# Altium schematic sheet WeatherBalloon_Main.SchDoc
size B; SheetNumber: 1; SheetTotal: 1
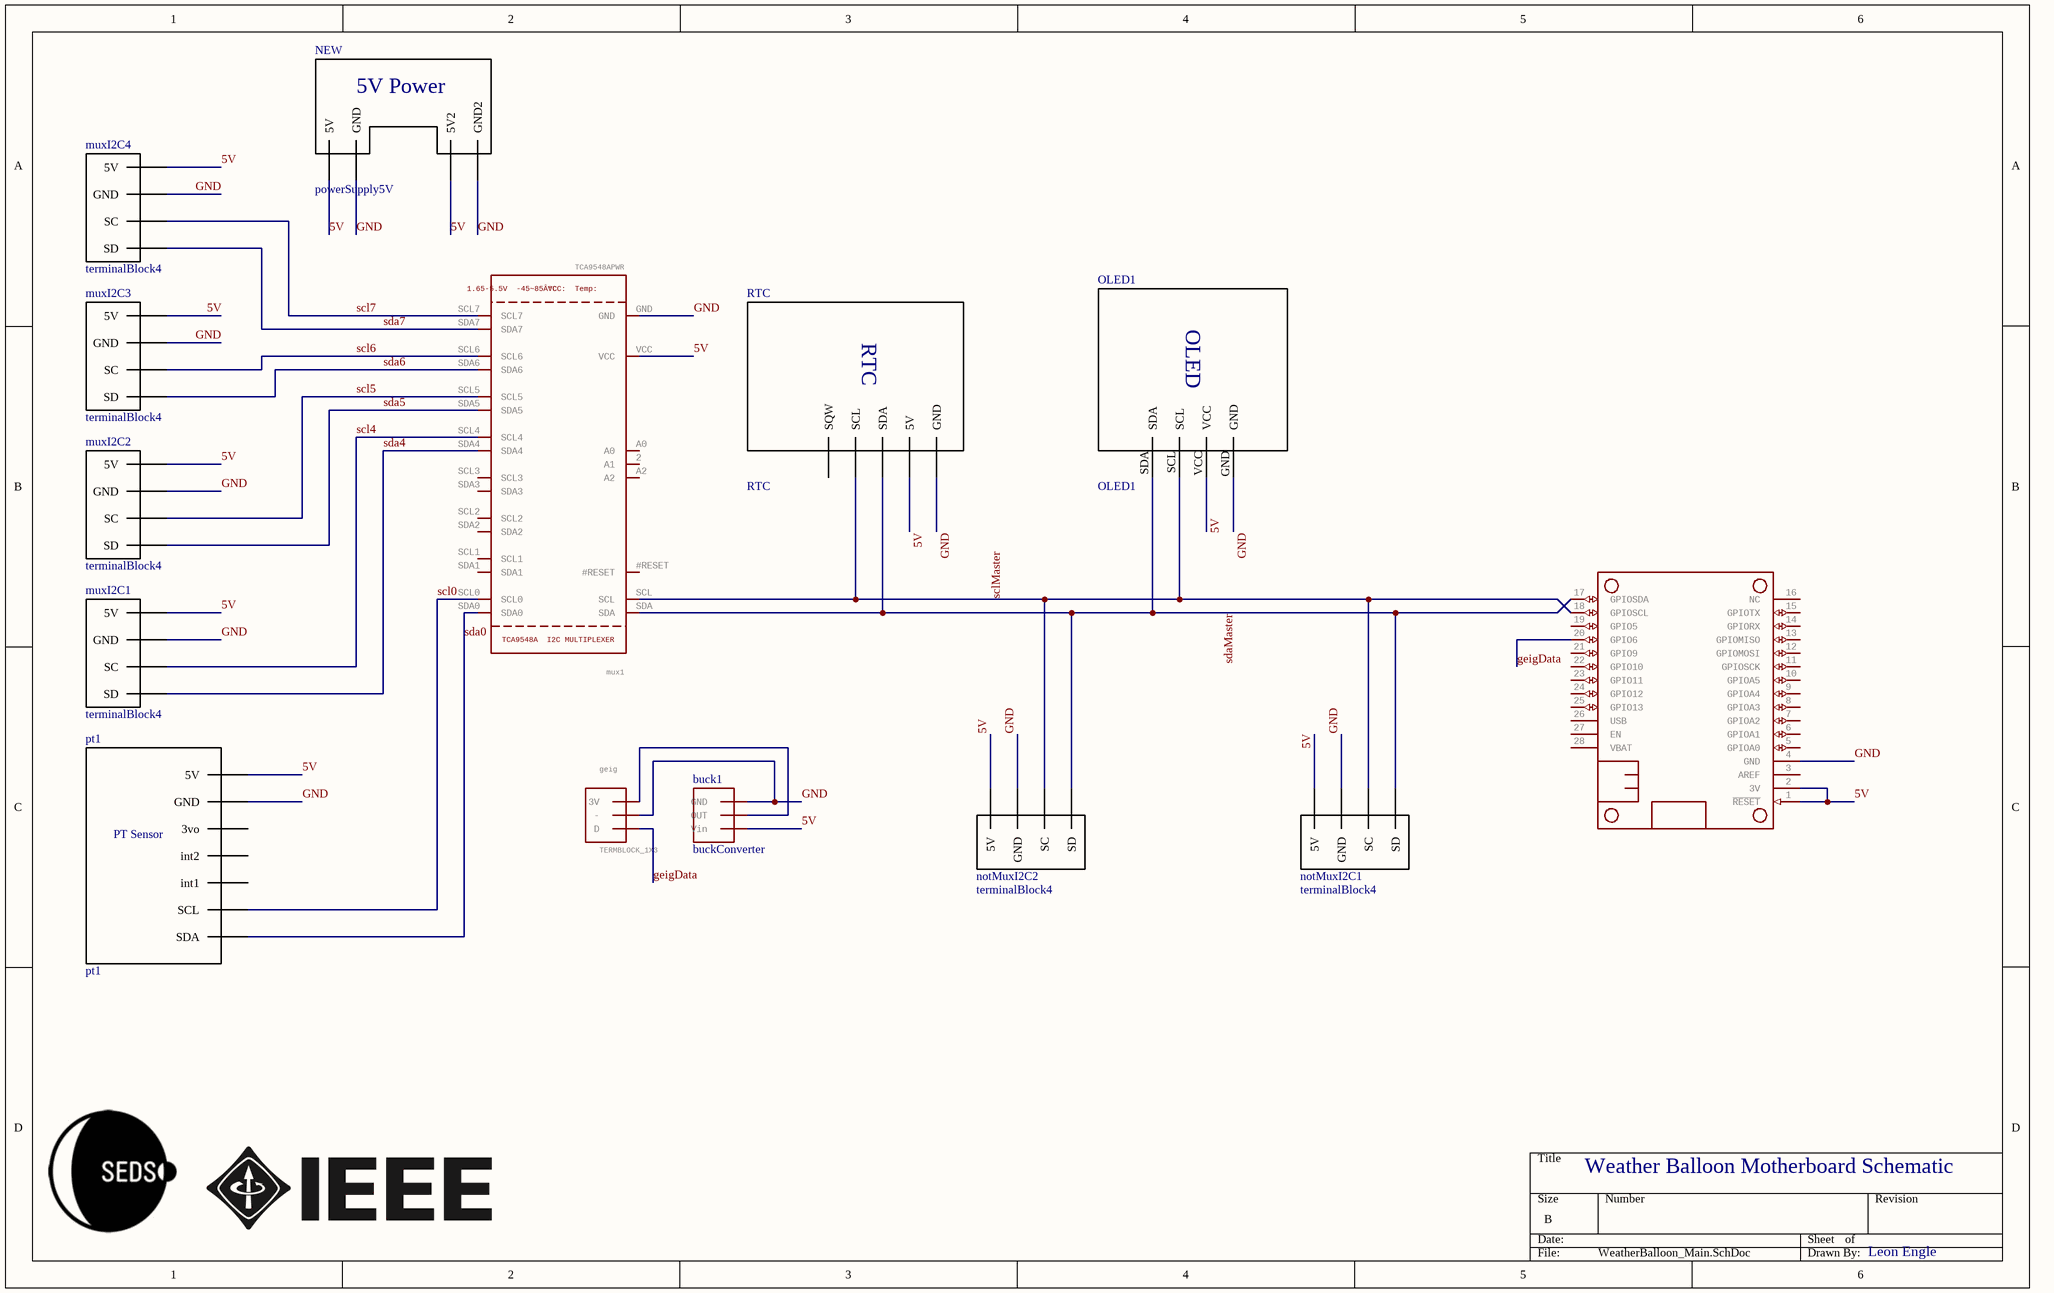
[diagram p0: WeatherBalloon_Main.SchDoc]

## Parts
buck1  buckConverter  [buckConverter]
geig  TERMBLOCK_1X3  [terminal3]
MS?  FEATHERWING_NODIM  [FEATHERWING_DIM]  (value not drawn)
mux1  TCA9548APWR  TCA9548A
I2CMULTIPLEXER: TCA9548A / I2C MULTIPLEXER  VCC:
Temp: VCC: / Temp:  1.65-5.5V
-45~85Â°C: 1.65-5.5V / -45~85Â°C  [multiplexer]
muxI2C1  terminalBlock4  [terminalBlock4]
muxI2C2  terminalBlock4  [terminalBlock4]
muxI2C3  terminalBlock4  [terminalBlock4]
muxI2C4  terminalBlock4  [terminalBlock4]
NEW  powerSupply5V  [powerSupply5V]
notMuxI2C1  terminalBlock4  [terminalBlock4]
notMuxI2C2  terminalBlock4  [terminalBlock4]
OLED1  OLED1  [OLED]
pt1  pt1  [PTsensor]
RTC  RTC  [RTC]

## Nets
5V: buck1.Vin MS?.1(~{RESET}) MS?.2(3V) mux1.VCC muxI2C1.5V muxI2C2.5V muxI2C3.5V muxI2C4.5V NEW.5V NEW.5V2 notMuxI2C1.5V notMuxI2C2.5V OLED1.VCC pt1.5V RTC.5V
geigData: geig.D MS?.20(GPIO6)
GND: buck1.GND geig.- MS?.4(GND) mux1.GND muxI2C1.GND muxI2C2.GND muxI2C3.GND muxI2C4.GND NEW.GND NEW.GND2 notMuxI2C1.GND notMuxI2C2.GND OLED1.GND pt1.GND RTC.GND
scl0: mux1.SCL0 pt1.SCL
scl4: mux1.SCL4 muxI2C1.SC
scl5: mux1.SCL5 muxI2C2.SC
scl6: mux1.SCL6 muxI2C3.SC
scl7: mux1.SCL7 muxI2C4.SC
sclMaster: MS?.18(GPIOSCL) mux1.SCL notMuxI2C1.SC notMuxI2C2.SC OLED1.SCL RTC.SCL
sda0: mux1.SDA0 pt1.SDA
sda4: mux1.SDA4 muxI2C1.SD
sda5: mux1.SDA5 muxI2C2.SD
sda6: mux1.SDA6 muxI2C3.SD
sda7: mux1.SDA7 muxI2C4.SD
sdaMaster: MS?.17(GPIOSDA) mux1.SDA notMuxI2C1.SD notMuxI2C2.SD OLED1.SDA RTC.SDA
Netbuck1_OUT: buck1.OUT geig.3V

Not connected (* = marked no-connect by the designer): MS? 3(AREF) 5(GPIOA0) 6(GPIOA1) 7(GPIOA2) 8(GPIOA3) 9(GPIOA4) 10(GPIOA5) 11(GPIOSCK) 12(GPIOMOSI) 13(GPIOMISO) 14(GPIORX) 15(GPIOTX) 16(NC) 19(GPIO5) 21(GPIO9) 22(GPIO10) 23(GPIO11) 24(GPIO12) 25(GPIO13) 26(USB) 27(EN) 28(VBAT); mux1 2(A1) #RESET A0 A2 SCL1 SCL2 SCL3 SDA1 SDA2 SDA3; pt1 3vo int1 int2; RTC SQW

## Notes on the sheet
- Weather Balloon Motherboard Schematic
- Leon Engle
- (in symbol powerSupply5V) 5V Power
- (in symbol PTsensor) PT Sensor

## Library data of the parts
geig = terminal3: 3.5mm Terminal block    http://www.ladyada.net/library/pcb/eaglelibrary.html; GateName_1: G$1; SymbolName_1: 1X3; LibraryName: microbuilder; DeviceSetName: TERMBLOCK_1X3
MS? = FEATHERWING_NODIM: GateName_1: G$1; SymbolName_1: MICROSHIELD; DeviceName: _NODIM; LibraryName: microbuilder; DeviceSetName: FEATHERWING
mux1 = multiplexer: TCA9548A I2C Multiplexer; GateName_1: G$1; SymbolName_1: TCA9548A; LibraryName: microbuilder; DeviceSetName: TCA9548A
muxI2C1-muxI2C4 notMuxI2C1 notMuxI2C2 = terminalBlock4: Terminal Block with 4 pins, intended for I2C interfacing.
NEW = powerSupply5V: 5V power supply for solderless breadboard
OLED1 = OLED: OLED screen
pt1 = PTsensor